# Altium schematic sheet ethernet.SchDoc
size Letter; CompanyName: Signal Laboratories, Inc.; Address1: 3479 Edison Way; Address2: Menlo Park CA 94025; Address3: +1 (877) 778-8435; Address4: siglabs.com; Revision: 1; SheetNumber: 32; SheetTotal: 53
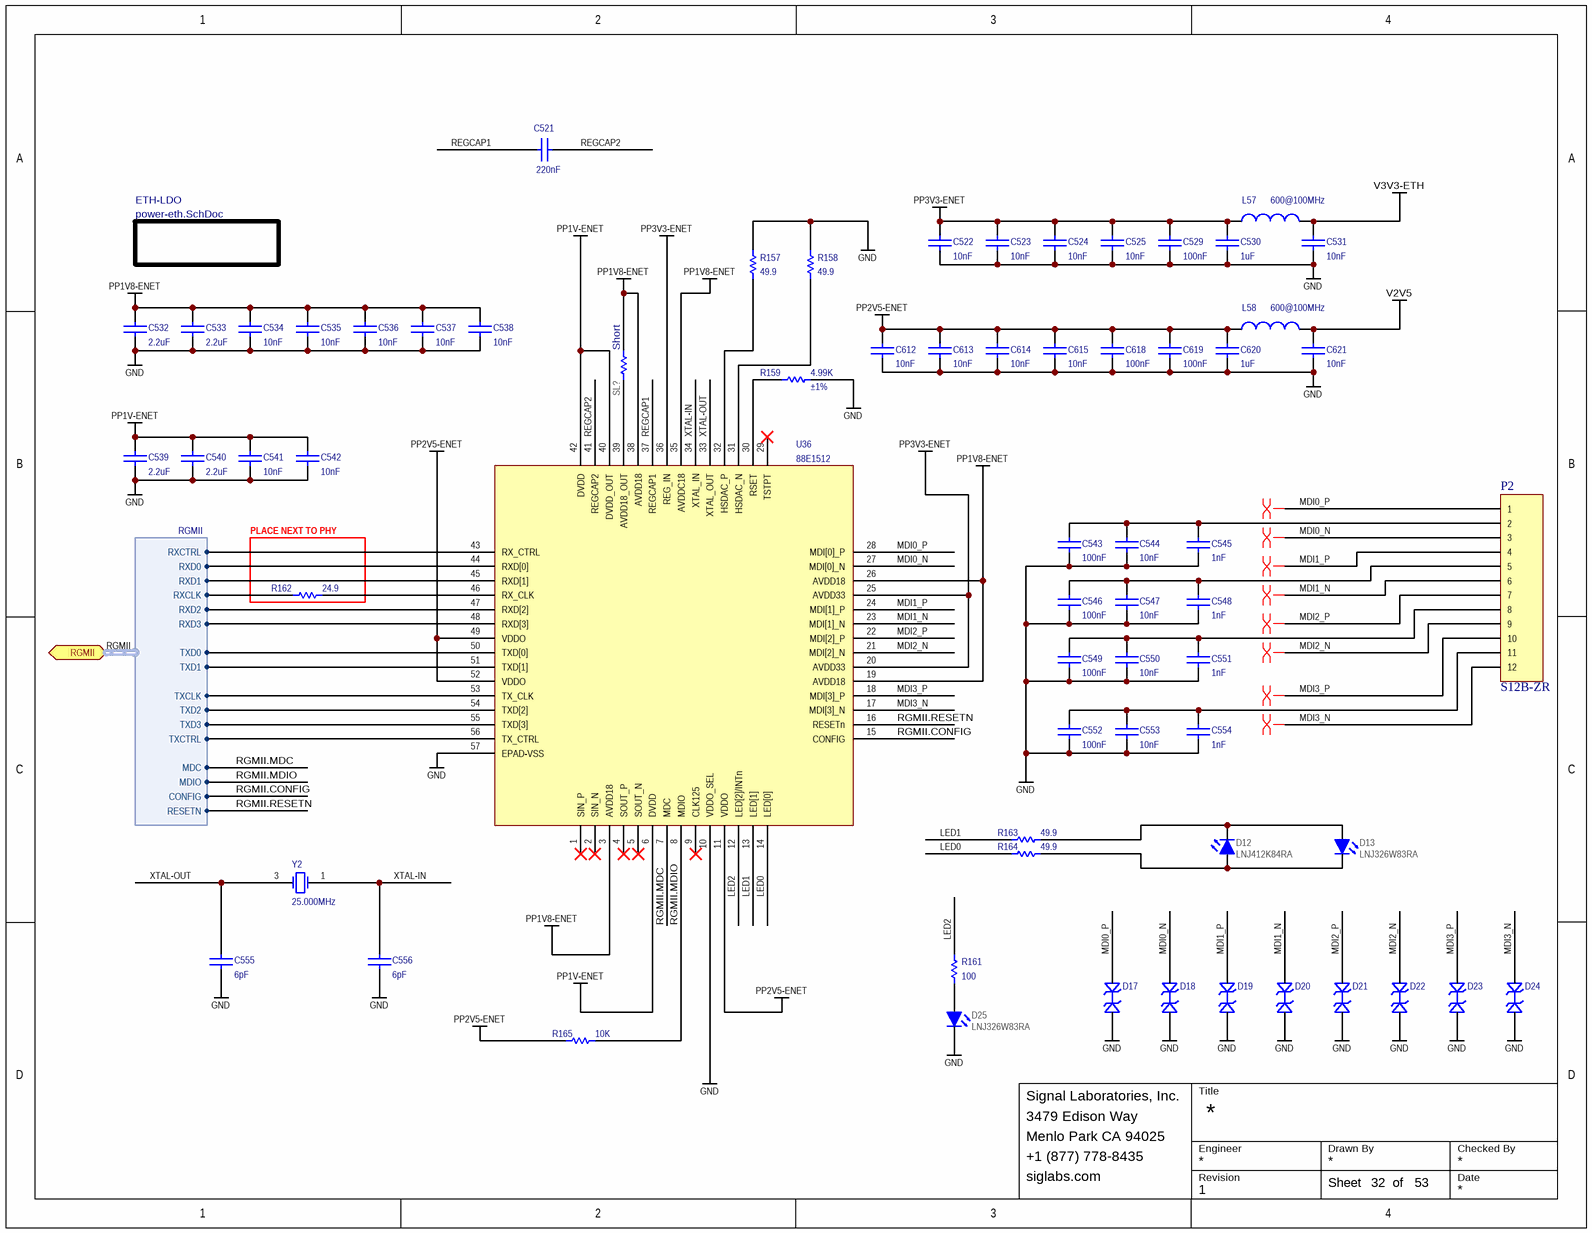
[diagram p0: ethernet.SchDoc]

## Parts
C521  value 220nF  [CAPC100X50X55L25N]  (hidden comment: GRM155R71C224KA12D)
C522  value 10nF  [CAPC100X50X55L25N]  (hidden comment: GRM155R71H103KA88)
C523  value 10nF  [CAPC100X50X55L25N]  (hidden comment: GRM155R71H103KA88)
C524  value 10nF  [CAPC100X50X55L25N]  (hidden comment: GRM155R71H103KA88)
C525  value 10nF  [CAPC100X50X55L25N]  (hidden comment: GRM155R71H103KA88)
C529  value 100nF  [CAPC100X50X55L25N]  (hidden comment: GRM155R71C104KA88J)
C530  value 1uF  [CAPC100X50X55L25N]  (hidden comment: GRM155R61A105KE15D)
C531  value 10nF  [CAPC100X50X55L25N]  (hidden comment: GRM155R71H103KA88)
C532  value 2.2uF  [0805]  (hidden comment: GRM188R71A225KE15D)
C533  value 2.2uF  [0805]  (hidden comment: GRM188R71A225KE15D)
C534  value 10nF  [CAPC100X50X55L25N]  (hidden comment: GRM155R71H103KA88)
C535  value 10nF  [CAPC100X50X55L25N]  (hidden comment: GRM155R71H103KA88)
C536  value 10nF  [CAPC100X50X55L25N]  (hidden comment: GRM155R71H103KA88)
C537  value 10nF  [CAPC100X50X55L25N]  (hidden comment: GRM155R71H103KA88)
C538  value 10nF  [CAPC100X50X55L25N]  (hidden comment: GRM155R71H103KA88)
C539  value 2.2uF  [0805]  (hidden comment: GRM188R71A225KE15D)
C540  value 2.2uF  [0805]  (hidden comment: GRM188R71A225KE15D)
C541  value 10nF  [CAPC100X50X55L25N]  (hidden comment: GRM155R71H103KA88)
C542  value 10nF  [CAPC100X50X55L25N]  (hidden comment: GRM155R71H103KA88)
C543  value 100nF  [CAPC100X50X55L25N]  (hidden comment: GRM155R71C104KA88J)
C544  value 10nF  [CAPC100X50X55L25N]  (hidden comment: GRM155R71H103KA88)
C545  value 1nF  [CAPC100X50X55L25N]  (hidden comment: GRM155R71H102KA01)
C546  value 100nF  [CAPC100X50X55L25N]  (hidden comment: GRM155R71C104KA88J)
C547  value 10nF  [CAPC100X50X55L25N]  (hidden comment: GRM155R71H103KA88)
C548  value 1nF  [CAPC100X50X55L25N]  (hidden comment: GRM155R71H102KA01)
C549  value 100nF  [CAPC100X50X55L25N]  (hidden comment: GRM155R71C104KA88J)
C550  value 10nF  [CAPC100X50X55L25N]  (hidden comment: GRM155R71H103KA88)
C551  value 1nF  [CAPC100X50X55L25N]  (hidden comment: GRM155R71H102KA01)
C552  value 100nF  [CAPC100X50X55L25N]  (hidden comment: GRM155R71C104KA88J)
C553  value 10nF  [CAPC100X50X55L25N]  (hidden comment: GRM155R71H103KA88)
C554  value 1nF  [CAPC100X50X55L25N]  (hidden comment: GRM155R71H102KA01)
C555  value 6pF  [CAPC100X50X55L25N]  (hidden comment: GJM1555C1H6R0CB01D)
C556  value 6pF  [CAPC100X50X55L25N]  (hidden comment: GJM1555C1H6R0CB01D)
C612  value 10nF  [CAPC100X50X55L25N]  (hidden comment: GRM155R71H103KA88)
C613  value 10nF  [CAPC100X50X55L25N]  (hidden comment: GRM155R71H103KA88)
C614  value 10nF  [CAPC100X50X55L25N]  (hidden comment: GRM155R71H103KA88)
C615  value 10nF  [CAPC100X50X55L25N]  (hidden comment: GRM155R71H103KA88)
C618  value 100nF  [CAPC100X50X55L25N]  (hidden comment: GRM155R71C104KA88J)
C619  value 100nF  [CAPC100X50X55L25N]  (hidden comment: GRM155R71C104KA88J)
C620  value 1uF  [CAPC100X50X55L25N]  (hidden comment: GRM155R61A105KE15D)
C621  value 10nF  [CAPC100X50X55L25N]  (hidden comment: GRM155R71H103KA88)
D12  LNJ412K84RA  [0603_LED]
D13  LNJ326W83RA  [0603_LED]
D17  ESD8472  [XFDFN-2]  (value not drawn)
D18  ESD8472  [XFDFN-2]  (value not drawn)
D19  ESD8472  [XFDFN-2]  (value not drawn)
D20  ESD8472  [XFDFN-2]  (value not drawn)
D21  ESD8472  [XFDFN-2]  (value not drawn)
D22  ESD8472  [XFDFN-2]  (value not drawn)
D23  ESD8472  [XFDFN-2]  (value not drawn)
D24  ESD8472  [XFDFN-2]  (value not drawn)
D25  LNJ326W83RA  [0603_LED]
L57  value 600@100MHz  [INDC1005X55N]  (hidden comment: BLM15PX601SN1D)
L58  value 600@100MHz  [INDC1005X55N]  (hidden comment: BLM15PX601SN1D)
P2  S12B-ZR  [S12B-ZR]
R157  value 49.9  [RESC1005X40N]  (hidden comment: ERA-2AEB49R9X)
R158  value 49.9  [RESC1005X40N]  (hidden comment: ERA-2AEB49R9X)
R159  value 4.99K  Tolerance: ±1%  [RESC1005X40N]  (hidden comment: ERJ-2RKF4991X)
R161  value 100  [RESC1005X40N]  (hidden comment: ERA-2AEB101X)
R162  value 24.9  [0603]  (hidden comment: ERJ-3EKF24R9V)
R163  value 49.9  [RESC1005X40N]  (hidden comment: ERA-2AEB49R9X)
R164  value 49.9  [RESC1005X40N]  (hidden comment: ERA-2AEB49R9X)
R165  value 10K  [RESC1005X40N]  (hidden comment: ERJ-2RKF1002X)
SL?  Notes: Short  [SOLDERLINK0603X26N_BRIDGED]  (hidden comment: SOLDER_LINK)  (no BOM)
U36  88E1512  [QFN-56]
Y2  Freq: 25.000MHz  [XRCGB]  (hidden comment: XRCGB25M000F3N00R0)

## Blocks framed on the sheet
PLACE NEXT TO PHY: R162

## Sub-sheets
ETH-LDO = power-eth.SchDoc: no entries

## Ports
RGMII (harness RGMII)

## Harnesses
RGMII: RXCTRL, RXD0, RXD1, RXD2, RXD3, RXCLK, TXCTRL, TXD0, TXD1, TXD2, TXD3, TXCLK, MDC, MDIO, RESETN, CONFIG

## Nets
GND: C522.1 C523.1 C524.1 C525.1 C529.1 C530.1 C531.1 C532.1 C533.1 C534.1 C535.1 C536.1 C537.1 C538.1 C539.1 C540.1 C541.1 C542.1 C543.1 C544.1 C545.1 C546.1 C547.1 C548.1 C549.1 C550.1 C551.1 C552.1 C553.1 C554.1 C555.1 C556.1 C612.1 C613.1 C614.1 C615.1 C618.1 C619.1 C620.1 C621.1 D17.2 D18.2 D19.2 D20.2 D21.2 D22.2 D23.2 D24.2 D25.2(K) R157.1 R158.1 R159.1 U36.10(VDDO_SEL) U36.57(EPAD-VSS)
PP1V8-ENET: C532.2 C533.2 C534.2 C535.2 C536.2 C537.2 C538.2 SL?.1 U36.3(AVDD18) U36.19(AVDD18) U36.26(AVDD18) U36.35(AVDDC18) U36.38(AVDD18)
PP1V-ENET: C539.2 C540.2 C541.2 C542.2 U36.6(DVDD) U36.40(DVDD_OUT) U36.42(DVDD)
PP2V5-ENET: C612.2 C613.2 C614.2 C615.2 C618.2 C619.2 C620.2 L58.2 R165.2 U36.11(VDDO) U36.49(VDDO) U36.52(VDDO)
PP3V3-ENET: C522.2 C523.2 C524.2 C525.2 C529.2 C530.2 L57.2 U36.20(AVDD33) U36.25(AVDD33) U36.36(REG_IN)
V2V5: C621.2 L58.1
V3V3-ETH: C531.2 L57.1
LED0: R164.2 U36.14(LED[0])
LED1: R163.2 U36.13(LED[1])
LED2: R161.1 U36.12(LED[2]/INTn)
MDI0_N: D18.1 P2.3 U36.27(MDI[0]_N)
MDI0_P: D17.1 P2.1 U36.28(MDI[0]_P)
MDI1_N: D20.1 P2.6 U36.23(MDI[1]_N)
MDI1_P: D19.1 P2.4 U36.24(MDI[1]_P)
MDI2_N: D22.1 P2.9 U36.21(MDI[2]_N)
MDI2_P: D21.1 P2.7 U36.22(MDI[2]_P)
MDI3_N: D24.1 P2.12 U36.17(MDI[3]_N)
MDI3_P: D23.1 P2.10 U36.18(MDI[3]_P)
REGCAP1: C521.1 U36.37(REGCAP1)
REGCAP2: C521.2 U36.41(REGCAP2)
RGMII.CONFIG: U36.15(CONFIG) ; port RGMII.CONFIG
RGMII.MDC: U36.7(MDC) ; port RGMII.MDC
RGMII.MDIO: R165.1 U36.8(MDIO) ; port RGMII.MDIO
RGMII.RESETN: U36.16(RESETn) ; port RGMII.RESETN
RGMII.RXCLK: R162.1 ; port RGMII.RXCLK
RGMII.RXCTRL: U36.43(RX_CTRL) ; port RGMII.RXCTRL
RGMII.RXD0: U36.44(RXD[0]) ; port RGMII.RXD0
RGMII.RXD1: U36.45(RXD[1]) ; port RGMII.RXD1
RGMII.RXD2: U36.47(RXD[2]) ; port RGMII.RXD2
RGMII.RXD3: U36.48(RXD[3]) ; port RGMII.RXD3
RGMII.TXCLK: U36.53(TX_CLK) ; port RGMII.TXCLK
RGMII.TXCTRL: U36.56(TX_CTRL) ; port RGMII.TXCTRL
RGMII.TXD0: U36.50(TXD[0]) ; port RGMII.TXD0
RGMII.TXD1: U36.51(TXD[1]) ; port RGMII.TXD1
RGMII.TXD2: U36.54(TXD[2]) ; port RGMII.TXD2
RGMII.TXD3: U36.55(TXD[3]) ; port RGMII.TXD3
XTAL-IN: C556.2 U36.34(XTAL_IN) Y2.1(OSC1)
XTAL-OUT: C555.2 U36.33(XTAL_OUT) Y2.3(OSC2)
NetC543_2: C543.2 C544.2 C545.2 P2.2
NetC546_2: C546.2 C547.2 C548.2 P2.5
NetC549_2: C549.2 C550.2 C551.2 P2.8
NetC552_2: C552.2 C553.2 C554.2 P2.11
NetD12_1: D12.1(A) D13.2(K) R164.1
NetD12_2: D12.2(K) D13.1(A) R163.1
NetD25_1: D25.1(A) R161.2
NetR157_2: R157.2 U36.32(HSDAC_P)
NetR158_2: R158.2 U36.31(HSDAC_N)
NetR159_2: R159.2 U36.30(RSET)
NetR162_2: R162.2 U36.46(RX_CLK)
NetSL?_2: SL?.2 U36.39(AVDD18_OUT)

Not connected (* = marked no-connect by the designer): U36 1(SIN_P)* 2(SIN_N)* 4(SOUT_P)* 5(SOUT_N)* 9(CLK125)* 29(TSTPT)*; Y2 2(NC) 4(NC)

## Buses and harness runs
harness RGMII = port RGMII

## Layout directives
differential pair: MDI0_N, MDI0_P, MDI1_N, MDI1_P, MDI2_N, MDI2_P, MDI3_N, MDI3_P

## Notes on the sheet
- Title
- Engineer
- Revision
- Drawn By
- Checked By
- Date
- Sheet
- of

## Library data of the parts
C521 = CAP 0402: Ceramic Capacitor 220nF ±10% 16V X7R 0402; Manufacturer: Murata; Tolerance: +/-10%; Tr: -55:125; Voltage: 16V; Manufacturer P/N: GRM155R71C224KA12D; Package: 0402
C522-C525 C531 C534-C538 C541 C542 C544 C547 C550 C553 C612-C615 C621 = CAP 0402: Ceramic Capacitor 10nF ±10% 50V X7R 0402; Manufacturer: Murata; Tr: -55:125; Voltage: 50V; Manufacturer P/N: GRM155R71H103KA88; Package: 0402; Tolerance: ±10%
C529 C543 C546 C549 C552 C618 C619 = CAP 0402: Ceramic Capacitor 100nF ±10% 16V X7R 0402; Manufacturer: Murata; Tr: -55:125; Voltage: 16V; Manufacturer P/N: GRM155R71C104KA88J; Package: 0402; Tolerance: ±10%
C530 C620 = CAP 0402: Ceramic Capacitor 1uF ±10% 10V X5R 0402; Manufacturer: Murata; Tr: -55:125; Voltage: 10V; Manufacturer P/N: GRM155R61A105KE15D; Package: 0402; Tolerance: ±10%
C532 C533 C539 C540 = CAP 0805: Ceramic Capacitor 2.2uF ±10% 10V X7R 0603; Manufacturer: Murata; Tr: -55:125; Voltage: 10V; Manufacturer P/N: GRM188R71A225KE15D; Package: 0603; Do Not Place: *; Tolerance: ±10%
C545 C548 C551 C554 = CAP 0402: Ceramic Capacitor 1nF ±10% 50V X7R 0402; Manufacturer: Murata; Tolerance: ±5%; Tr: -55:125; Voltage: 50V; Manufacturer P/N: GRM155R71H102KA01; Package: CAPC100X50X55L25N
C555 C556 = CAP 0402: Ceramic Capacitor 6pF ±0.25pF 50V NP0 RF 0402; Manufacturer: Murata; Tr: -55:125; Voltage: 50V; Manufacturer P/N: GJM1555C1H6R0CB01D; Package: 0402; Tolerance: ±0.25pF
D12 = LED0603Y: LED, SMT 0603, Color Amber, 10mA, 2.05V; Manufacturer: Panasonic; Manufacturer P/N: LNJ412K84RA; Package: 0603 Polarized
D13 D25 = LED0603GR: LED, SMT 0603, Color Green, 10mA, 2.05V; Manufacturer: Panasonic; Manufacturer P/N: LNJ326W83RA; Package: 0603 Polarized
D17-D24 = ESD8472: ESD Protection Diode; Manufacturer: On Semiconductor; Manufacturer P/N: ESD8472MUT5G
L57 L58 = IND 0402: Ferrite Bead 600-Ohm @ 100MHz 900mA 0402; Manufacturer: Murata; Tolerance: ±25%; Tr: -55:125; Manufacturer P/N: BLM15PX601SN1D; Package: 0402
P2 = S12B-ZR: 1.5mm pitch right angle 12-position; Manufacturer: JST; Manufacturer P/N: S12B-ZR
R157 R158 R163 R164 = RES 0402: Thin Film Resistor 49.9 ±0.1% 0402; Manufacturer: Panasonic; Tr: -55:155; Package: 0402; Manufacturer P/N: ERA-2AEB49R9X; Tolerance: ±0.1%
R159 = RES 0402: Thick Film Resistor 4.99k ±1% 0402; Manufacturer: Panasonic; Tr: -55:155; Package: 0402; Manufacturer P/N: ERJ-2RKF4991X
R161 = RES 0402: Thin Film Resistor 100 ±0.1% 0402; Manufacturer: Panasonic; Tr: -55:155; Package: 0402; Manufacturer P/N: ERA-2AEB101X; Tolerance: ±0.1%
R162 = RES 0603: Thick Film Resistor 24.9 ±1% 0603; Manufacturer: Panasonic; Tr: -55:155; Package: 0603; Manufacturer P/N: ERJ-3EKF24R9V; Do Not Place: *; Tolerance: ±1%
R165 = RES 0402: Thick Film 10k ±1% 0402; Manufacturer: Panasonic; Tr: -55:155; Package: 0402; Manufacturer P/N: ERJ-2RKF1002X; Tolerance: ±1%
SL? = RES: Solder Link; Manufacturer P/N: *; Manufacturer: *
U36 = 88E1512: Alaska Intergrated 1000/100/10 Ethernet PHY; Manufacturer: Marvell; Manufacturer P/N: 88E1512; Package: QFN-56
Y2 = XRCGB25M000F3N00R0: CRYSTAL, 25.000MHz, 30ppm, 6pF; Manufacturer: Murata; Manufacturer P/N: XRCGB25M000F3N00R0; C: 6pF